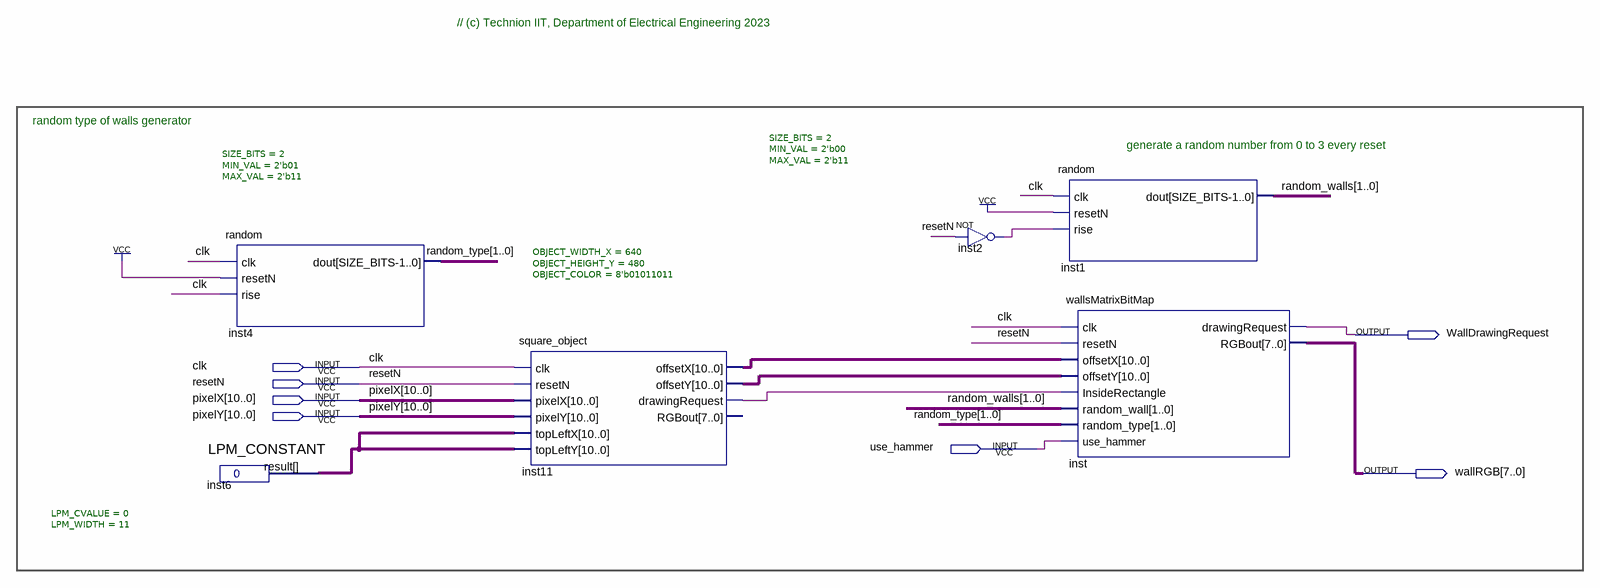
[diagram p0: schematic sheet]
// Quartus schematic WALLS_DISPLAY.bdf as structural Verilog: 6 symbols, 7 pins
module WALLS_DISPLAY (
  input  clk,
  input  resetN,
  input  [10:0] pixelX,
  input  [10:0] pixelY,
  input  use_hammer,
  output WallDrawingRequest,
  output [7:0] wallRGB
);

  wire inst2_out, inst11_drawingrequest;
  wire [1:0] random_type, random_walls;
  wire [10:0] inst6_result, inst11_offsetx, inst11_offsety;

  random #(.SIZE_BITS(2), .MIN_VAL(2'b01), .MAX_VAL(2'b11)) inst4 (
    .clk(clk), .resetN(1'b1), .rise(clk), .dout(random_type));
  LPM_CONSTANT #(.LPM_CVALUE(0), .LPM_WIDTH(11)) inst6 (.result(inst6_result));
  square_object #(.OBJECT_WIDTH_X(640), .OBJECT_HEIGHT_Y(480), .OBJECT_COLOR(8'b01011011)) inst11 (
    .clk(clk), .resetN(resetN), .pixelX(pixelX), .pixelY(pixelY), .topLeftX(inst6_result),
    .topLeftY(inst6_result), .offsetX(inst11_offsetx), .offsetY(inst11_offsety),
    .drawingRequest(inst11_drawingrequest));  // open: RGBout
  not inst2 (inst2_out, resetN);
  random #(.SIZE_BITS(2), .MIN_VAL(2'b00), .MAX_VAL(2'b11)) inst1 (
    .clk(clk), .resetN(1'b1), .rise(inst2_out), .dout(random_walls));
  wallsMatrixBitMap inst (
    .clk(clk), .resetN(resetN), .offsetX(inst11_offsetx), .offsetY(inst11_offsety),
    .InsideRectangle(inst11_drawingrequest), .random_wall(random_walls), .random_type(random_type),
    .use_hammer(use_hammer), .drawingRequest(WallDrawingRequest), .RGBout(wallRGB));

  // Notes on the sheet:
  //   // (c) Technion IIT, Department of Electrical Engineering 2023
  //   random type of walls generator
  //   generate a random number from 0 to 3 every reset
endmodule
